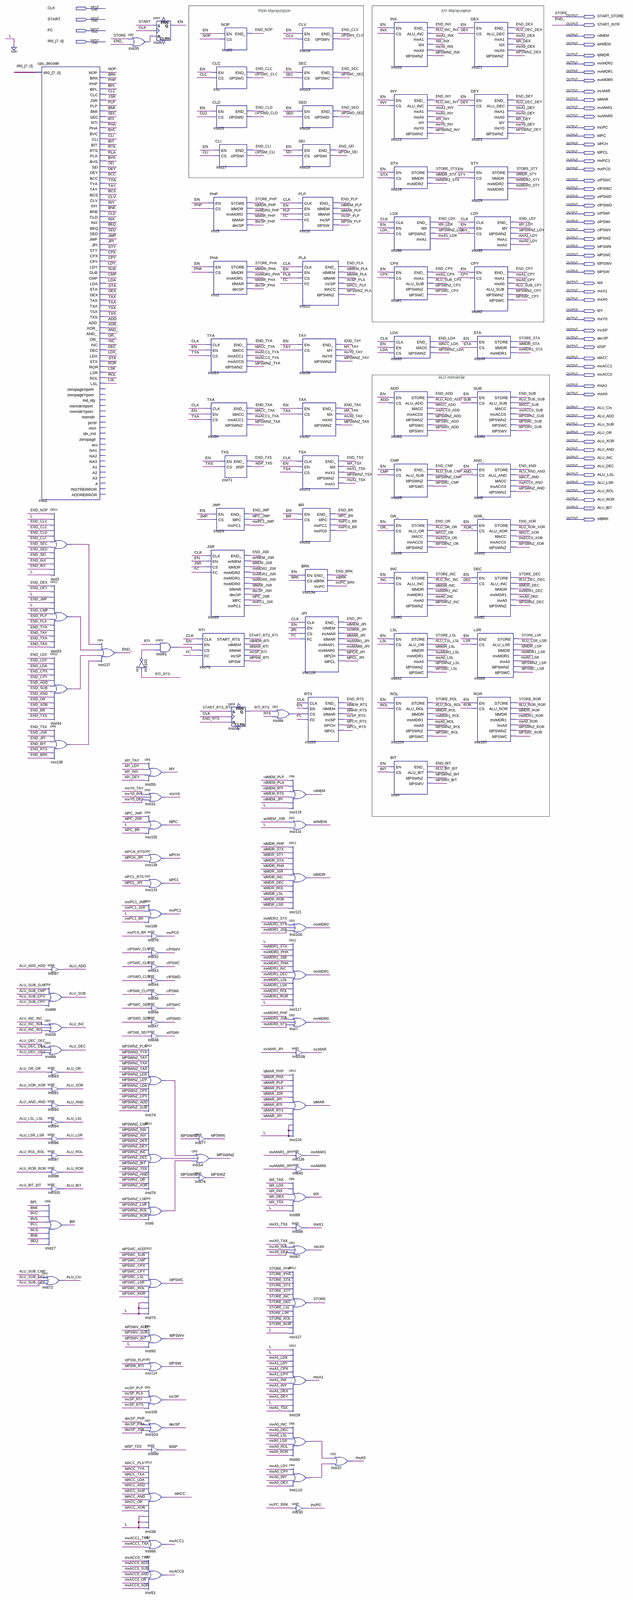
[diagram p0: schematic sheet, whole]
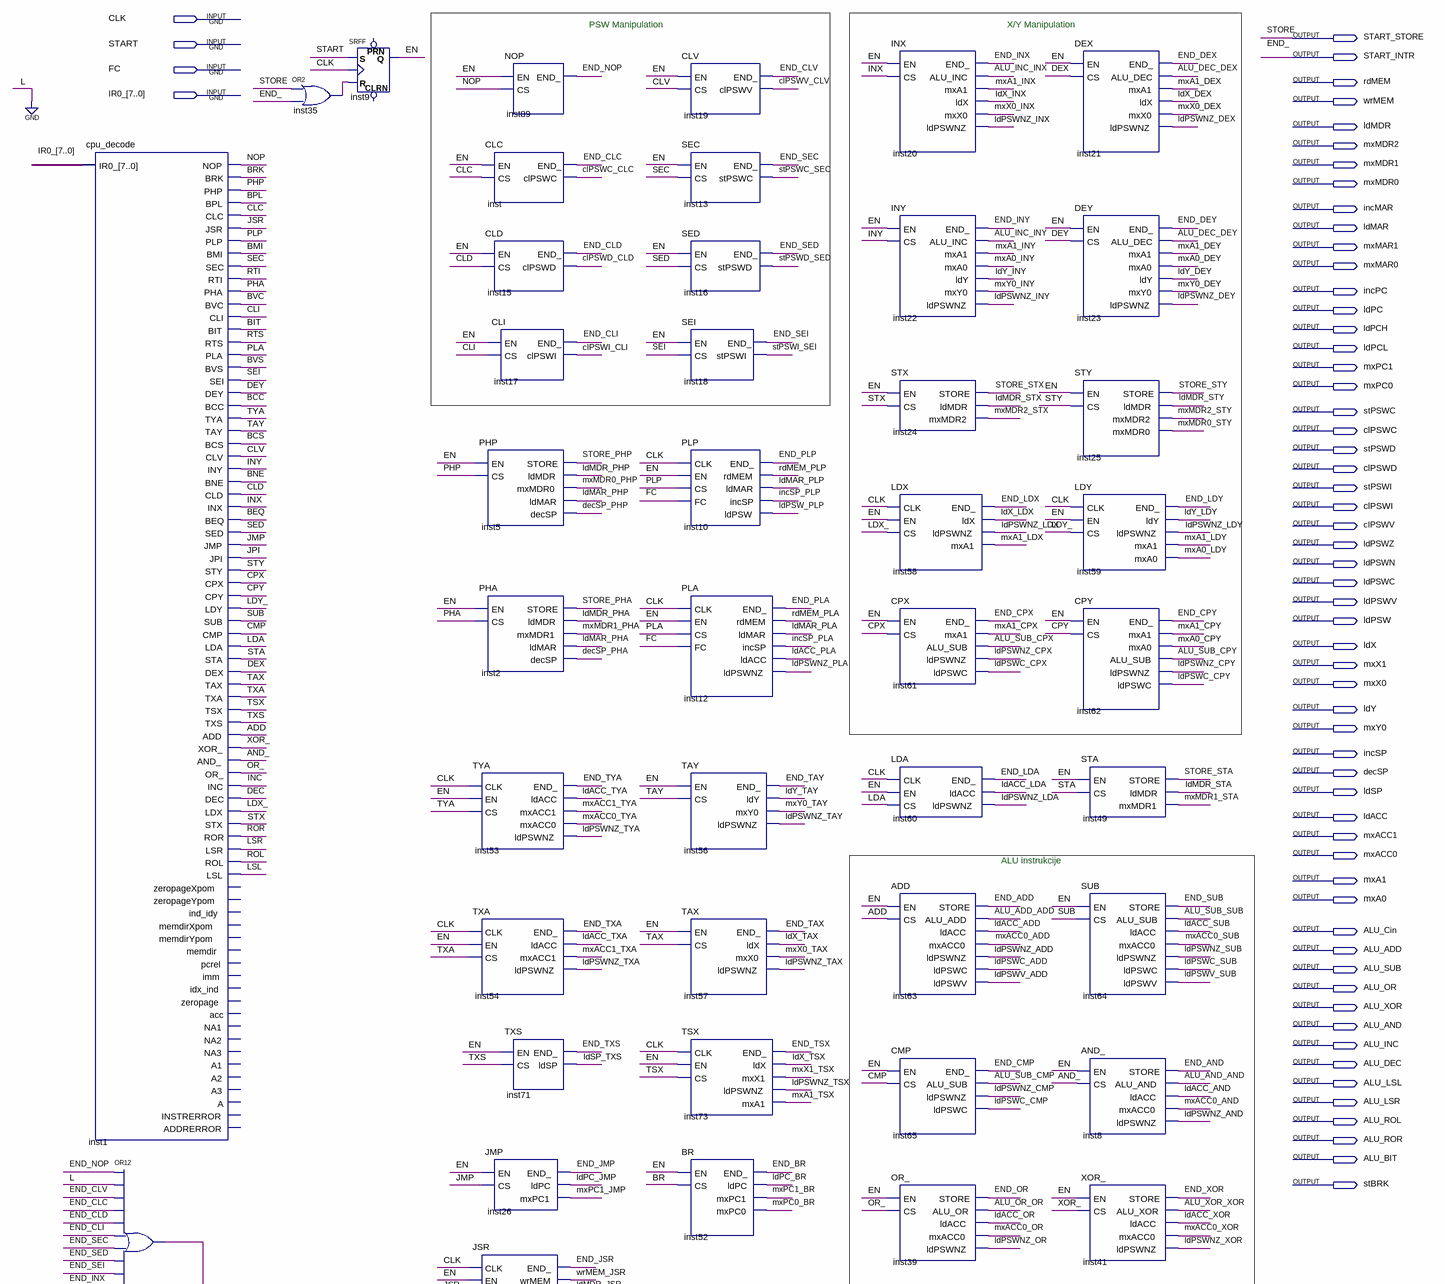
[diagram p1: schematic sheet, upper part]
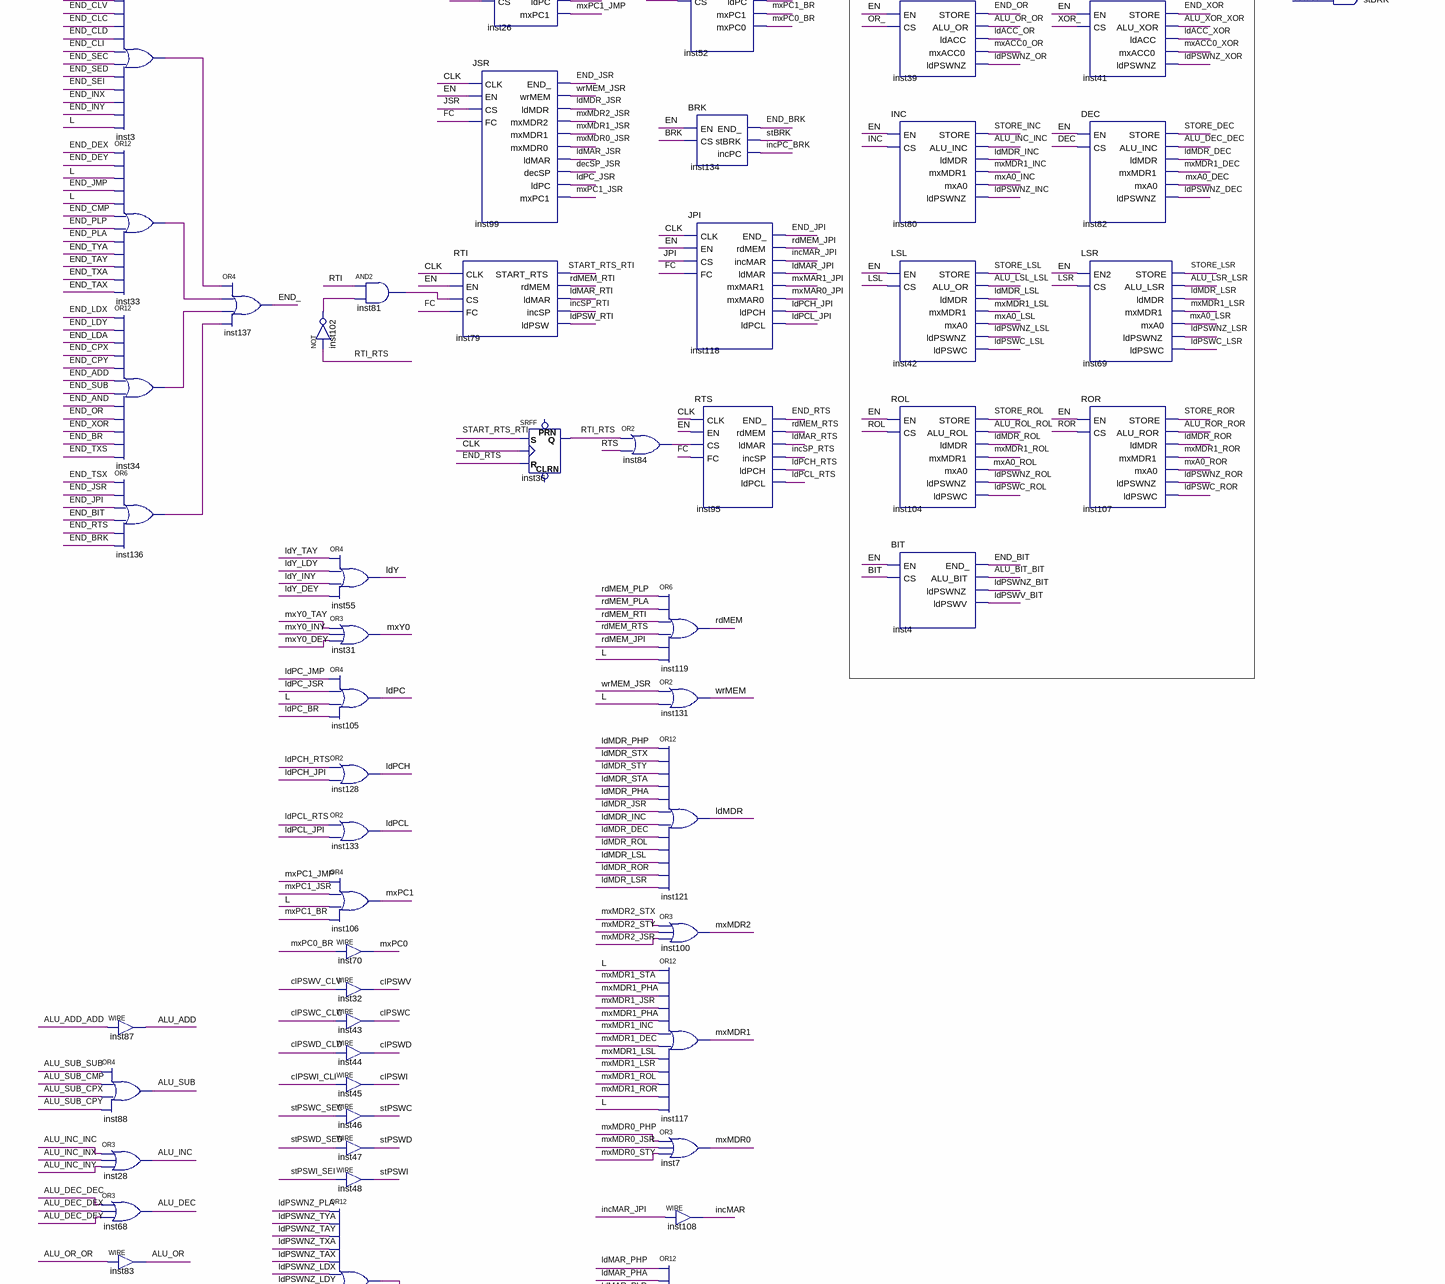
[diagram p2: schematic sheet, middle part]
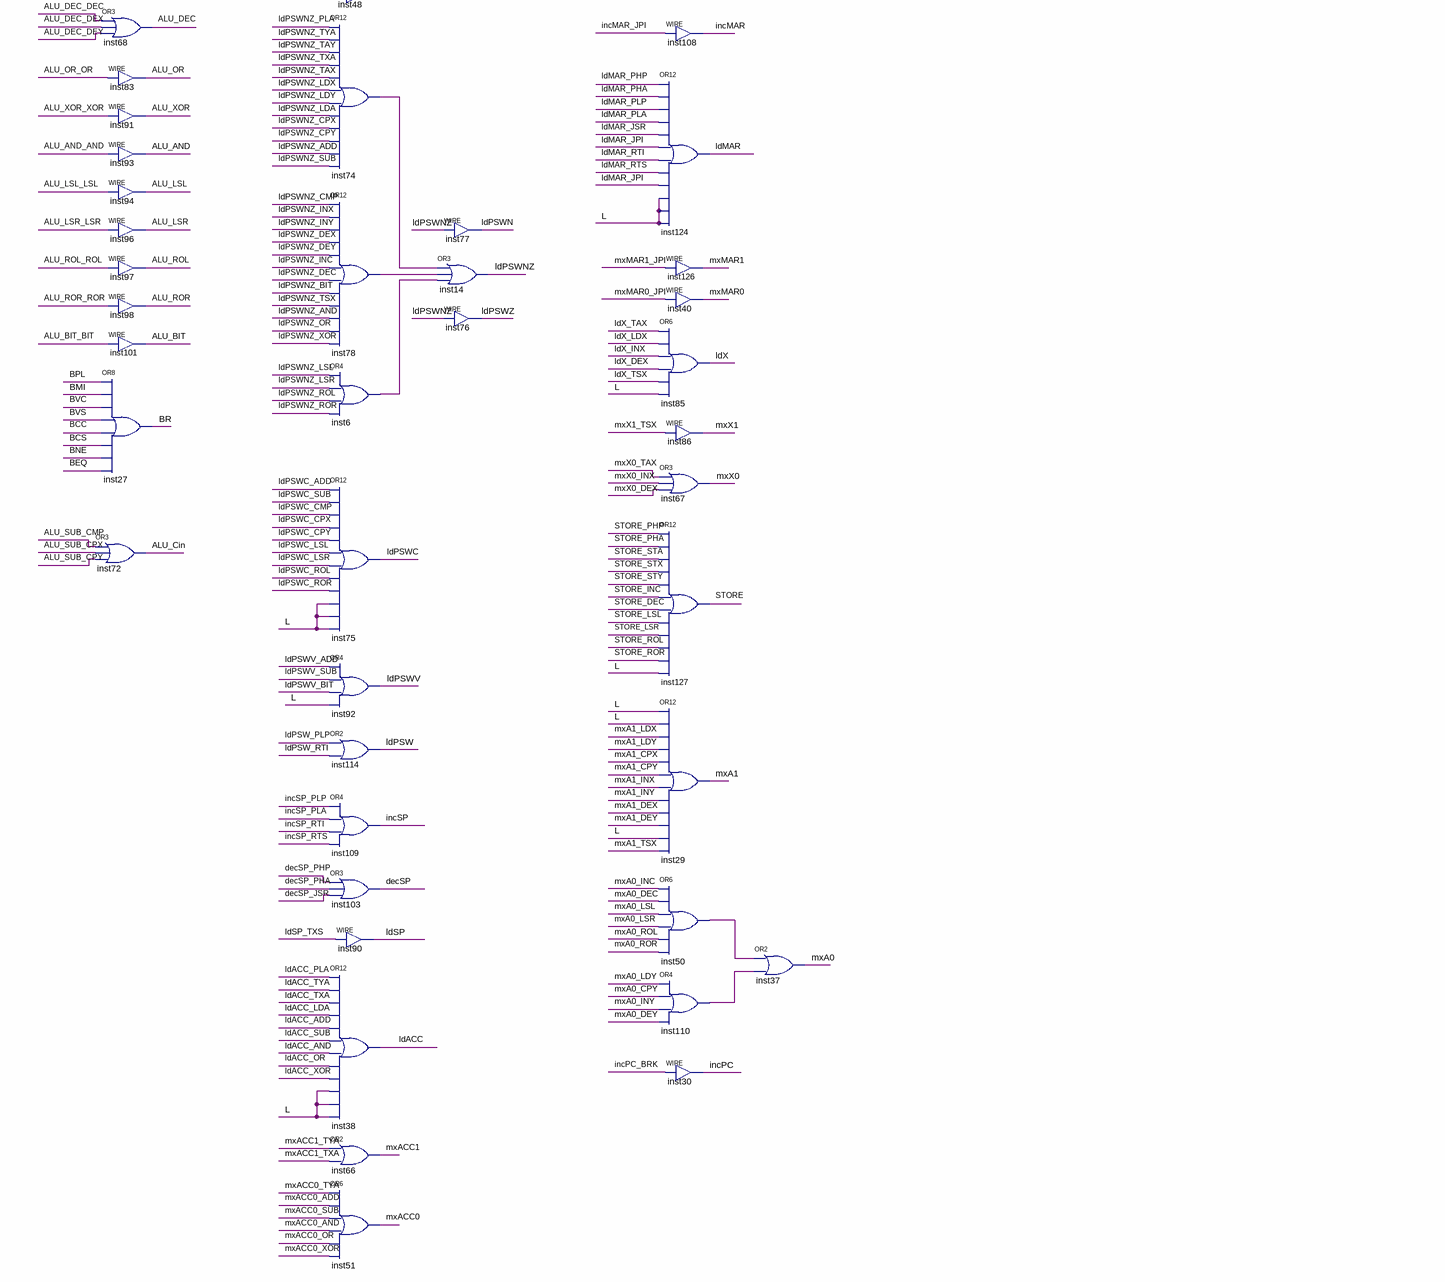
[diagram p3: schematic sheet, lower part]
// Quartus schematic cpu_exec.bdf as structural Verilog: 124 symbols, 61 pins
module cpu_exec (
  input  CLK,
  input  START,
  input  FC,
  input  [7:0] IR0_,
  output START_STORE,
  output START_INTR,
  output rdMEM,
  output wrMEM,
  output ldMDR,
  output mxMDR2,
  output mxMDR1,
  output mxMDR0,
  output incMAR,
  output ldMAR,
  output mxMAR1,
  output mxMAR0,
  output incPC,
  output ldPC,
  output ldPCH,
  output ldPCL,
  output mxPC1,
  output mxPC0,
  output stPSWC,
  output clPSWC,
  output stPSWD,
  output clPSWD,
  output stPSWI,
  output clPSWI,
  output clPSWV,
  output ldPSWZ,
  output ldPSWN,
  output ldPSWC,
  output ldPSWV,
  output ldPSW,
  output ldX,
  output mxX1,
  output mxX0,
  output ldY,
  output mxY0,
  output incSP,
  output decSP,
  output ldSP,
  output ldACC,
  output mxACC1,
  output mxACC0,
  output mxA1,
  output mxA0,
  output ALU_Cin,
  output ALU_ADD,
  output ALU_SUB,
  output ALU_OR,
  output ALU_XOR,
  output ALU_AND,
  output ALU_INC,
  output ALU_DEC,
  output ALU_LSL,
  output ALU_LSR,
  output ALU_ROL,
  output ALU_ROR,
  output ALU_BIT,
  output stBRK
);

  wire ADD, ALU_ADD_ADD, ALU_AND_AND, ALU_BIT_BIT, ALU_DEC_DEC, ALU_DEC_DEX, ALU_DEC_DEY, ALU_INC_INC,
       ALU_INC_INX, ALU_INC_INY, ALU_LSL_LSL, ALU_LSR_LSR, ALU_OR_OR, ALU_ROL_ROL, ALU_ROR_ROR, ALU_SUB_CMP,
       ALU_SUB_CPX, ALU_SUB_CPY, ALU_SUB_SUB, ALU_XOR_XOR, AND_, BCC, BCS, BEQ, BIT, BMI, BNE, BPL, BR, BRK,
       BVC, BVS, CLC, CLD, CLI, clPSWC_CLC, clPSWD_CLD, clPSWI_CLI, clPSWV_CLV, CLV, CMP, CPX, CPY, DEC,
       decSP_JSR, decSP_PHA, decSP_PHP, DEX, DEY, EN, END_ADD, END_AND, END_BIT, END_BR, END_BRK, END_CLC,
       END_CLD, END_CLI, END_CLV, END_CMP, END_CPX, END_CPY, END_DEX, END_DEY, END_INX, END_INY, END_JMP,
       END_JPI, END_JSR, END_LDA, END_LDX, END_LDY, END_NOP, END_OR, END_PLA, END_PLP, END_RTS, END_SEC,
       END_SED, END_SEI, END_SUB, END_TAX, END_TAY, END_TSX, END_TXA, END_TXS, END_TYA, END_XOR, INC,
       incMAR_JPI, incPC_BRK, incSP_PLA, incSP_PLP, incSP_RTI, incSP_RTS, inst3_out, inst6_out, inst33_out,
       inst34_out, inst35_out, inst50_out, inst74_out, inst78_out, inst81_out, inst84_out, inst102_out,
       inst110_out, inst136_out, INX, INY, JMP, JPI, JSR, LDA, ldACC_ADD, ldACC_AND, ldACC_LDA, ldACC_OR,
       ldACC_PLA, ldACC_SUB, ldACC_TXA, ldACC_TYA, ldACC_XOR, ldMAR_JPI, ldMAR_JSR, ldMAR_PHA, ldMAR_PHP,
       ldMAR_PLA, ldMAR_PLP, ldMAR_RTI, ldMAR_RTS, ldMDR_DEC, ldMDR_INC, ldMDR_JSR, ldMDR_LSL, ldMDR_LSR,
       ldMDR_PHA, ldMDR_PHP, ldMDR_ROL, ldMDR_ROR, ldMDR_STA, ldMDR_STX, ldMDR_STY, ldPC_BR, ldPC_JMP,
       ldPC_JSR, ldPCH_JPI, ldPCH_RTS, ldPCL_JPI, ldPCL_RTS, ldPSW_PLP, ldPSW_RTI, ldPSWC_ADD, ldPSWC_CMP,
       ldPSWC_CPX, ldPSWC_CPY, ldPSWC_LSL, ldPSWC_LSR, ldPSWC_ROL, ldPSWC_ROR, ldPSWC_SUB, ldPSWNZ,
       ldPSWNZ_ADD, ldPSWNZ_AND, ldPSWNZ_BIT, ldPSWNZ_CMP, ldPSWNZ_CPX, ldPSWNZ_CPY, ldPSWNZ_DEC,
       ldPSWNZ_DEX, ldPSWNZ_DEY, ldPSWNZ_INC, ldPSWNZ_INX, ldPSWNZ_INY, ldPSWNZ_LDA, ldPSWNZ_LDX,
       ldPSWNZ_LDY, ldPSWNZ_LSL, ldPSWNZ_LSR, ldPSWNZ_OR, ldPSWNZ_PLA, ldPSWNZ_ROL, ldPSWNZ_ROR, ldPSWNZ_SUB,
       ldPSWNZ_TAX, ldPSWNZ_TAY, ldPSWNZ_TSX, ldPSWNZ_TXA, ldPSWNZ_TYA, ldPSWNZ_XOR, ldPSWV_ADD, ldPSWV_BIT,
       ldPSWV_SUB, ldSP_TXS, LDX_, ldX_DEX, ldX_INX, ldX_LDX, ldX_TAX, ldX_TSX, LDY_, ldY_DEY, ldY_INY,
       ldY_LDY, ldY_TAY, LSL, LSR, mxA0_CPY, mxA0_DEC, mxA0_DEY, mxA0_INC, mxA0_INY, mxA0_LDY, mxA0_LSL,
       mxA0_LSR, mxA0_ROL, mxA0_ROR, mxA1_CPX, mxA1_CPY, mxA1_DEX, mxA1_DEY, mxA1_INX, mxA1_INY, mxA1_LDX,
       mxA1_LDY, mxA1_TSX, mxACC0_ADD, mxACC0_AND, mxACC0_OR, mxACC0_SUB, mxACC0_TYA, mxACC0_XOR, mxACC1_TXA,
       mxACC1_TYA, mxMAR0_JPI, mxMAR1_JPI, mxMDR0_JSR, mxMDR0_PHP, mxMDR0_STY, mxMDR1_DEC, mxMDR1_INC,
       mxMDR1_JSR, mxMDR1_LSL, mxMDR1_LSR, mxMDR1_PHA, mxMDR1_ROL, mxMDR1_ROR, mxMDR1_STA, mxMDR2_JSR,
       mxMDR2_STX, mxMDR2_STY, mxPC0_BR, mxPC1_BR, mxPC1_JMP, mxPC1_JSR, mxX0_DEX, mxX0_INX, mxX0_TAX,
       mxX1_TSX, mxY0_DEY, mxY0_INY, mxY0_TAY, NOP, OR_, PHA, PHP, PLA, PLP, rdMEM_JPI, rdMEM_PLA, rdMEM_PLP,
       rdMEM_RTI, rdMEM_RTS, ROL, ROR, RTI, RTI_RTS, RTS, SEC, SED, SEI, STA, START_RTS_RTI, STORE_DEC,
       STORE_INC, STORE_LSL, STORE_LSR, STORE_PHA, STORE_PHP, STORE_ROL, STORE_ROR, STORE_STA, STORE_STX,
       STORE_STY, stPSWC_SEC, stPSWD_SED, stPSWI_SEI, STX, STY, SUB, TAX, TAY, TSX, TXA, TXS, TYA, wrMEM_JSR,
       XOR_;

  cpu_decode inst1 (
    .IR0_(IR0_), .NOP(NOP), .BRK(BRK), .PHP(PHP), .BPL(BPL), .CLC(CLC), .JSR(JSR), .PLP(PLP), .BMI(BMI),
    .SEC(SEC), .RTI(RTI), .PHA(PHA), .BVC(BVC), .CLI(CLI), .BIT(BIT), .RTS(RTS), .PLA(PLA), .BVS(BVS),
    .SEI(SEI), .DEY(DEY), .BCC(BCC), .TYA(TYA), .TAY(TAY), .BCS(BCS), .CLV(CLV), .INY(INY), .BNE(BNE),
    .CLD(CLD), .INX(INX), .BEQ(BEQ), .SED(SED), .JMP(JMP), .JPI(JPI), .STY(STY), .CPX(CPX), .CPY(CPY),
    .LDY(LDY_), .SUB(SUB), .CMP(CMP), .LDA(LDA), .STA(STA), .DEX(DEX), .TAX(TAX), .TXA(TXA), .TSX(TSX),
    .TXS(TXS), .ADD(ADD), .XOR_(XOR_), .AND_(AND_), .OR_(OR_), .INC(INC), .DEC(DEC), .LDX(LDX_), .STX(STX),
    .ROR(ROR), .LSR(LSR), .ROL(ROL), .LSL(LSL));  // open: zeropageXpom, zeropageYpom, ind_idy, memdirXpom, memdirYpom, memdir, pcrel, imm, idx_ind, zeropage, acc, NA1, NA2, NA3, A1, A2, A3, A, INSTRERROR, ADDRERROR
  or inst72 (ALU_Cin, ALU_SUB_CMP, ALU_SUB_CPX, ALU_SUB_CPY);
  or inst3 (inst3_out, END_NOP, 1'b0, END_CLV, END_CLC, END_CLD, END_CLI, END_SEC, END_SED, END_SEI, END_INX, END_INY, 1'b0);
  or inst33 (inst33_out, END_DEX, END_DEY, 1'b0, END_JMP, 1'b0, END_CMP, END_PLP, END_PLA, END_TYA, END_TAY, END_TXA, END_TAX);
  or inst34 (inst34_out, END_LDX, END_LDY, END_LDA, END_CPX, END_CPY, END_ADD, END_SUB, END_AND, END_OR, END_XOR, END_BR, END_TXS);
  or inst136 (inst136_out, END_TSX, END_JSR, END_JPI, END_BIT, END_RTS, END_BRK);
  assign ALU_ADD = ALU_ADD_ADD;  // WIRE inst87
  or inst88 (ALU_SUB, ALU_SUB_SUB, ALU_SUB_CMP, ALU_SUB_CPX, ALU_SUB_CPY);
  or inst28 (ALU_INC, ALU_INC_INC, ALU_INC_INX, ALU_INC_INY);
  or inst68 (ALU_DEC, ALU_DEC_DEC, ALU_DEC_DEX, ALU_DEC_DEY);
  assign ALU_OR = ALU_OR_OR;  // WIRE inst83
  assign ALU_XOR = ALU_XOR_XOR;  // WIRE inst91
  assign ALU_AND = ALU_AND_AND;  // WIRE inst93
  assign ALU_LSL = ALU_LSL_LSL;  // WIRE inst94
  assign ALU_LSR = ALU_LSR_LSR;  // WIRE inst96
  assign ALU_ROL = ALU_ROL_ROL;  // WIRE inst97
  assign ALU_ROR = ALU_ROR_ROR;  // WIRE inst98
  assign ALU_BIT = ALU_BIT_BIT;  // WIRE inst101
  or inst27 (BR, BPL, BMI, BVC, BVS, BCC, BCS, BNE, BEQ);
  or inst137 (START_INTR, inst3_out, inst33_out, inst34_out, inst136_out);
  or inst35 (inst35_out, START_STORE, START_INTR);
  SRFF inst9 (.S(START), .R(inst35_out), .CLK(CLK), .Q(EN));  // open: PRN, CLRN
  not inst102 (inst102_out, RTI_RTS);
  or inst55 (ldY, ldY_TAY, ldY_LDY, ldY_INY, ldY_DEY);
  or inst31 (mxY0, mxY0_TAY, mxY0_INY, mxY0_DEY);
  or inst105 (ldPC, ldPC_JMP, ldPC_JSR, 1'b0, ldPC_BR);
  or inst128 (ldPCH, ldPCH_RTS, ldPCH_JPI);
  or inst133 (ldPCL, ldPCL_RTS, ldPCL_JPI);
  or inst106 (mxPC1, mxPC1_JMP, mxPC1_JSR, 1'b0, mxPC1_BR);
  assign mxPC0 = mxPC0_BR;  // WIRE inst70
  assign clPSWV = clPSWV_CLV;  // WIRE inst32
  assign clPSWC = clPSWC_CLC;  // WIRE inst43
  assign clPSWD = clPSWD_CLD;  // WIRE inst44
  assign clPSWI = clPSWI_CLI;  // WIRE inst45
  assign stPSWC = stPSWC_SEC;  // WIRE inst46
  assign stPSWD = stPSWD_SED;  // WIRE inst47
  assign stPSWI = stPSWI_SEI;  // WIRE inst48
  or inst74 (inst74_out, ldPSWNZ_PLA, ldPSWNZ_TYA, ldPSWNZ_TAY, ldPSWNZ_TXA, ldPSWNZ_TAX, ldPSWNZ_LDX, ldPSWNZ_LDY, ldPSWNZ_LDA, ldPSWNZ_CPX, ldPSWNZ_CPY, ldPSWNZ_ADD, ldPSWNZ_SUB);
  or inst78 (inst78_out, ldPSWNZ_CMP, ldPSWNZ_INX, ldPSWNZ_INY, ldPSWNZ_DEX, ldPSWNZ_DEY, ldPSWNZ_INC, ldPSWNZ_DEC, ldPSWNZ_BIT, ldPSWNZ_TSX, ldPSWNZ_AND, ldPSWNZ_OR, ldPSWNZ_XOR);
  or inst6 (inst6_out, ldPSWNZ_LSL, ldPSWNZ_LSR, ldPSWNZ_ROL, ldPSWNZ_ROR);
  or inst75 (ldPSWC, ldPSWC_ADD, ldPSWC_SUB, ldPSWC_CMP, ldPSWC_CPX, ldPSWC_CPY, ldPSWC_LSL, ldPSWC_LSR, ldPSWC_ROL, ldPSWC_ROR, 1'b0, 1'b0, 1'b0);
  or inst92 (ldPSWV, ldPSWV_ADD, ldPSWV_SUB, ldPSWV_BIT, 1'b0);
  or inst114 (ldPSW, ldPSW_PLP, ldPSW_RTI);
  or inst109 (incSP, incSP_PLP, incSP_PLA, incSP_RTI, incSP_RTS);
  or inst103 (decSP, decSP_PHP, decSP_PHA, decSP_JSR);
  assign ldSP = ldSP_TXS;  // WIRE inst90
  or inst38 (ldACC, ldACC_PLA, ldACC_TYA, ldACC_TXA, ldACC_LDA, ldACC_ADD, ldACC_SUB, ldACC_AND, ldACC_OR, ldACC_XOR, 1'b0, 1'b0, 1'b0);
  or inst66 (mxACC1, mxACC1_TYA, mxACC1_TXA);
  or inst51 (mxACC0, mxACC0_TYA, mxACC0_ADD, mxACC0_SUB, mxACC0_AND, mxACC0_OR, mxACC0_XOR);
  and inst81 (inst81_out, RTI, inst102_out);
  RTI inst79 (
    .CLK(CLK), .EN(EN), .CS(inst81_out), .FC(FC), .START_RTS(START_RTS_RTI), .rdMEM(rdMEM_RTI),
    .ldMAR(ldMAR_RTI), .incSP(incSP_RTI), .ldPSW(ldPSW_RTI));
  assign ldPSWN = ldPSWNZ;  // WIRE inst77
  or inst14 (ldPSWNZ, inst74_out, inst78_out, inst6_out);
  assign ldPSWZ = ldPSWNZ;  // WIRE inst76
  NOP inst89 (.EN(EN), .CS(NOP), .END_(END_NOP));
  CLC inst (.EN(EN), .CS(CLC), .END_(END_CLC), .clPSWC(clPSWC_CLC));
  CLD inst15 (.EN(EN), .CS(CLD), .END_(END_CLD), .clPSWD(clPSWD_CLD));
  CLI inst17 (.EN(EN), .CS(CLI), .END_(END_CLI), .clPSWI(clPSWI_CLI));
  PHP inst5 (
    .EN(EN), .CS(PHP), .STORE(STORE_PHP), .ldMDR(ldMDR_PHP), .mxMDR0(mxMDR0_PHP), .ldMAR(ldMAR_PHP),
    .decSP(decSP_PHP));
  PHA inst2 (
    .EN(EN), .CS(PHA), .STORE(STORE_PHA), .ldMDR(ldMDR_PHA), .mxMDR1(mxMDR1_PHA), .ldMAR(ldMAR_PHA),
    .decSP(decSP_PHA));
  TYA inst53 (
    .CLK(CLK), .EN(EN), .CS(TYA), .END_(END_TYA), .ldACC(ldACC_TYA), .mxACC1(mxACC1_TYA),
    .mxACC0(mxACC0_TYA), .ldPSWNZ(ldPSWNZ_TYA));
  TXA inst54 (
    .CLK(CLK), .EN(EN), .CS(TXA), .END_(END_TXA), .ldACC(ldACC_TXA), .mxACC1(mxACC1_TXA),
    .ldPSWNZ(ldPSWNZ_TXA));
  TXS inst71 (.EN(EN), .CS(TXS), .END_(END_TXS), .ldSP(ldSP_TXS));
  JMP inst26 (.EN(EN), .CS(JMP), .END_(END_JMP), .ldPC(ldPC_JMP), .mxPC1(mxPC1_JMP));
  JSR inst99 (
    .CLK(CLK), .EN(EN), .CS(JSR), .FC(FC), .END_(END_JSR), .wrMEM(wrMEM_JSR), .ldMDR(ldMDR_JSR),
    .mxMDR2(mxMDR2_JSR), .mxMDR1(mxMDR1_JSR), .mxMDR0(mxMDR0_JSR), .ldMAR(ldMAR_JSR), .decSP(decSP_JSR),
    .ldPC(ldPC_JSR), .mxPC1(mxPC1_JSR));
  SRFF inst36 (.S(START_RTS_RTI), .R(END_RTS), .CLK(CLK), .Q(RTI_RTS));  // open: PRN, CLRN
  or inst84 (inst84_out, RTI_RTS, RTS);
  CLV inst19 (.EN(EN), .CS(CLV), .END_(END_CLV), .clPSWV(clPSWV_CLV));
  SEC inst13 (.EN(EN), .CS(SEC), .END_(END_SEC), .stPSWC(stPSWC_SEC));
  SED inst16 (.EN(EN), .CS(SED), .END_(END_SED), .stPSWD(stPSWD_SED));
  SEI inst18 (.EN(EN), .CS(SEI), .END_(END_SEI), .stPSWI(stPSWI_SEI));
  PLP inst10 (
    .CLK(CLK), .EN(EN), .CS(PLP), .FC(FC), .END_(END_PLP), .rdMEM(rdMEM_PLP), .ldMAR(ldMAR_PLP),
    .incSP(incSP_PLP), .ldPSW(ldPSW_PLP));
  PLA inst12 (
    .CLK(CLK), .EN(EN), .CS(PLA), .FC(FC), .END_(END_PLA), .rdMEM(rdMEM_PLA), .ldMAR(ldMAR_PLA),
    .incSP(incSP_PLA), .ldACC(ldACC_PLA), .ldPSWNZ(ldPSWNZ_PLA));
  TAY inst56 (.EN(EN), .CS(TAY), .END_(END_TAY), .ldY(ldY_TAY), .mxY0(mxY0_TAY), .ldPSWNZ(ldPSWNZ_TAY));
  TAX inst57 (.EN(EN), .CS(TAX), .END_(END_TAX), .ldX(ldX_TAX), .mxX0(mxX0_TAX), .ldPSWNZ(ldPSWNZ_TAX));
  TSX inst73 (
    .CLK(CLK), .EN(EN), .CS(TSX), .END_(END_TSX), .ldX(ldX_TSX), .mxX1(mxX1_TSX), .ldPSWNZ(ldPSWNZ_TSX),
    .mxA1(mxA1_TSX));
  BR inst52 (.EN(EN), .CS(BR), .END_(END_BR), .ldPC(ldPC_BR), .mxPC1(mxPC1_BR), .mxPC0(mxPC0_BR));
  BRK inst134 (.EN(EN), .CS(BRK), .END_(END_BRK), .stBRK(stBRK), .incPC(incPC_BRK));
  JPI inst118 (
    .CLK(CLK), .EN(EN), .CS(JPI), .FC(FC), .END_(END_JPI), .rdMEM(rdMEM_JPI), .incMAR(incMAR_JPI),
    .ldMAR(ldMAR_JPI), .mxMAR1(mxMAR1_JPI), .mxMAR0(mxMAR0_JPI), .ldPCH(ldPCH_JPI), .ldPCL(ldPCL_JPI));
  RTS inst95 (
    .CLK(CLK), .EN(EN), .CS(inst84_out), .FC(FC), .END_(END_RTS), .rdMEM(rdMEM_RTS), .ldMAR(ldMAR_RTS),
    .incSP(incSP_RTS), .ldPCH(ldPCH_RTS), .ldPCL(ldPCL_RTS));
  or inst119 (rdMEM, rdMEM_PLP, rdMEM_PLA, rdMEM_RTI, rdMEM_RTS, rdMEM_JPI, 1'b0);
  or inst131 (wrMEM, wrMEM_JSR, 1'b0);
  or inst121 (ldMDR, ldMDR_PHP, ldMDR_STX, ldMDR_STY, ldMDR_STA, ldMDR_PHA, ldMDR_JSR, ldMDR_INC, ldMDR_DEC, ldMDR_ROL, ldMDR_LSL, ldMDR_ROR, ldMDR_LSR);
  or inst100 (mxMDR2, mxMDR2_STX, mxMDR2_STY, mxMDR2_JSR);
  or inst117 (mxMDR1, 1'b0, mxMDR1_STA, mxMDR1_PHA, mxMDR1_JSR, mxMDR1_PHA, mxMDR1_INC, mxMDR1_DEC, mxMDR1_LSL, mxMDR1_LSR, mxMDR1_ROL, mxMDR1_ROR, 1'b0);
  or inst7 (mxMDR0, mxMDR0_PHP, mxMDR0_JSR, mxMDR0_STY);
  assign incMAR = incMAR_JPI;  // WIRE inst108
  or inst124 (ldMAR, ldMAR_PHP, ldMAR_PHA, ldMAR_PLP, ldMAR_PLA, ldMAR_JSR, ldMAR_JPI, ldMAR_RTI, ldMAR_RTS, ldMAR_JPI, 1'b0, 1'b0, 1'b0);
  assign mxMAR1 = mxMAR1_JPI;  // WIRE inst126
  assign mxMAR0 = mxMAR0_JPI;  // WIRE inst40
  or inst85 (ldX, ldX_TAX, ldX_LDX, ldX_INX, ldX_DEX, ldX_TSX, 1'b0);
  assign mxX1 = mxX1_TSX;  // WIRE inst86
  or inst67 (mxX0, mxX0_TAX, mxX0_INX, mxX0_DEX);
  or inst127 (START_STORE, STORE_PHP, STORE_PHA, STORE_STA, STORE_STX, STORE_STY, STORE_INC, STORE_DEC, STORE_LSL, STORE_LSR, STORE_ROL, STORE_ROR, 1'b0);
  or inst29 (mxA1, 1'b0, 1'b0, mxA1_LDX, mxA1_LDY, mxA1_CPX, mxA1_CPY, mxA1_INX, mxA1_INY, mxA1_DEX, mxA1_DEY, 1'b0, mxA1_TSX);
  or inst50 (inst50_out, mxA0_INC, mxA0_DEC, mxA0_LSL, mxA0_LSR, mxA0_ROL, mxA0_ROR);
  or inst110 (inst110_out, mxA0_LDY, mxA0_CPY, mxA0_INY, mxA0_DEY);
  assign incPC = incPC_BRK;  // WIRE inst30
  or inst37 (mxA0, inst50_out, inst110_out);
  INX inst20 (
    .EN(EN), .CS(INX), .END_(END_INX), .ALU_INC(ALU_INC_INX), .mxA1(mxA1_INX), .ldX(ldX_INX),
    .mxX0(mxX0_INX), .ldPSWNZ(ldPSWNZ_INX));
  INY inst22 (
    .EN(EN), .CS(INY), .END_(END_INY), .ALU_INC(ALU_INC_INY), .mxA1(mxA1_INY), .mxA0(mxA0_INY),
    .ldY(ldY_INY), .mxY0(mxY0_INY), .ldPSWNZ(ldPSWNZ_INY));
  STX inst24 (.EN(EN), .CS(STX), .STORE(STORE_STX), .ldMDR(ldMDR_STX), .mxMDR2(mxMDR2_STX));
  LDX inst58 (.CLK(CLK), .EN(EN), .CS(LDX_), .END_(END_LDX), .ldX(ldX_LDX), .ldPSWNZ(ldPSWNZ_LDX), .mxA1(mxA1_LDX));
  CPX inst61 (
    .EN(EN), .CS(CPX), .END_(END_CPX), .mxA1(mxA1_CPX), .ALU_SUB(ALU_SUB_CPX), .ldPSWNZ(ldPSWNZ_CPX),
    .ldPSWC(ldPSWC_CPX));
  LDA inst60 (.CLK(CLK), .EN(EN), .CS(LDA), .END_(END_LDA), .ldACC(ldACC_LDA), .ldPSWNZ(ldPSWNZ_LDA));
  ADD inst63 (
    .EN(EN), .CS(ADD), .STORE(END_ADD), .ALU_ADD(ALU_ADD_ADD), .ldACC(ldACC_ADD), .mxACC0(mxACC0_ADD),
    .ldPSWNZ(ldPSWNZ_ADD), .ldPSWC(ldPSWC_ADD), .ldPSWV(ldPSWV_ADD));
  CMP inst65 (.EN(EN), .CS(CMP), .END_(END_CMP), .ALU_SUB(ALU_SUB_CMP), .ldPSWNZ(ldPSWNZ_CMP), .ldPSWC(ldPSWC_CMP));
  OR_ inst39 (
    .EN(EN), .CS(OR_), .STORE(END_OR), .ALU_OR(ALU_OR_OR), .ldACC(ldACC_OR), .mxACC0(mxACC0_OR),
    .ldPSWNZ(ldPSWNZ_OR));
  INC inst80 (
    .EN(EN), .CS(INC), .STORE(STORE_INC), .ALU_INC(ALU_INC_INC), .ldMDR(ldMDR_INC), .mxMDR1(mxMDR1_INC),
    .mxA0(mxA0_INC), .ldPSWNZ(ldPSWNZ_INC));
  LSL inst42 (
    .EN(EN), .CS(LSL), .STORE(STORE_LSL), .ALU_OR(ALU_LSL_LSL), .ldMDR(ldMDR_LSL), .mxMDR1(mxMDR1_LSL),
    .mxA0(mxA0_LSL), .ldPSWNZ(ldPSWNZ_LSL), .ldPSWC(ldPSWC_LSL));
  ROL inst104 (
    .EN(EN), .CS(ROL), .STORE(STORE_ROL), .ALU_ROL(ALU_ROL_ROL), .ldMDR(ldMDR_ROL), .mxMDR1(mxMDR1_ROL),
    .mxA0(mxA0_ROL), .ldPSWNZ(ldPSWNZ_ROL), .ldPSWC(ldPSWC_ROL));
  BIT inst4 (.EN(EN), .CS(BIT), .END_(END_BIT), .ALU_BIT(ALU_BIT_BIT), .ldPSWNZ(ldPSWNZ_BIT), .ldPSWV(ldPSWV_BIT));
  DEX inst21 (
    .EN(EN), .CS(DEX), .END_(END_DEX), .ALU_DEC(ALU_DEC_DEX), .mxA1(mxA1_DEX), .ldX(ldX_DEX),
    .mxX0(mxX0_DEX), .ldPSWNZ(ldPSWNZ_DEX));
  DEY inst23 (
    .EN(EN), .CS(DEY), .END_(END_DEY), .ALU_DEC(ALU_DEC_DEY), .mxA1(mxA1_DEY), .mxA0(mxA0_DEY),
    .ldY(ldY_DEY), .mxY0(mxY0_DEY), .ldPSWNZ(ldPSWNZ_DEY));
  STY inst25 (.EN(EN), .CS(STY), .STORE(STORE_STY), .ldMDR(ldMDR_STY), .mxMDR2(mxMDR2_STY), .mxMDR0(mxMDR0_STY));
  LDY inst59 (
    .CLK(CLK), .EN(EN), .CS(LDY_), .END_(END_LDY), .ldY(ldY_LDY), .ldPSWNZ(ldPSWNZ_LDY), .mxA1(mxA1_LDY),
    .mxA0(mxA0_LDY));
  CPY inst62 (
    .EN(EN), .CS(CPY), .END_(END_CPY), .mxA1(mxA1_CPY), .mxA0(mxA0_CPY), .ALU_SUB(ALU_SUB_CPY),
    .ldPSWNZ(ldPSWNZ_CPY), .ldPSWC(ldPSWC_CPY));
  STA inst49 (.EN(EN), .CS(STA), .STORE(STORE_STA), .ldMDR(ldMDR_STA), .mxMDR1(mxMDR1_STA));
  SUB inst64 (
    .EN(EN), .CS(SUB), .STORE(END_SUB), .ALU_SUB(ALU_SUB_SUB), .ldACC(ldACC_SUB), .mxACC0(mxACC0_SUB),
    .ldPSWNZ(ldPSWNZ_SUB), .ldPSWC(ldPSWC_SUB), .ldPSWV(ldPSWV_SUB));
  AND_ inst8 (
    .EN(EN), .CS(AND_), .STORE(END_AND), .ALU_AND(ALU_AND_AND), .ldACC(ldACC_AND), .mxACC0(mxACC0_AND),
    .ldPSWNZ(ldPSWNZ_AND));
  XOR_ inst41 (
    .EN(EN), .CS(XOR_), .STORE(END_XOR), .ALU_XOR(ALU_XOR_XOR), .ldACC(ldACC_XOR), .mxACC0(mxACC0_XOR),
    .ldPSWNZ(ldPSWNZ_XOR));
  DEC inst82 (
    .EN(EN), .CS(DEC), .STORE(STORE_DEC), .ALU_INC(ALU_DEC_DEC), .ldMDR(ldMDR_DEC), .mxMDR1(mxMDR1_DEC),
    .mxA0(mxA0_DEC), .ldPSWNZ(ldPSWNZ_DEC));
  LSR inst69 (
    .EN2(EN), .CS(LSR), .STORE(STORE_LSR), .ALU_LSR(ALU_LSR_LSR), .ldMDR(ldMDR_LSR), .mxMDR1(mxMDR1_LSR),
    .mxA0(mxA0_LSR), .ldPSWNZ(ldPSWNZ_LSR), .ldPSWC(ldPSWC_LSR));
  ROR inst107 (
    .EN(EN), .CS(ROR), .STORE(STORE_ROR), .ALU_ROR(ALU_ROR_ROR), .ldMDR(ldMDR_ROR), .mxMDR1(mxMDR1_ROR),
    .mxA0(mxA0_ROR), .ldPSWNZ(ldPSWNZ_ROR), .ldPSWC(ldPSWC_ROR));

  // Other names for the same wires on the sheet: END_ = START_INTR; STORE = START_STORE

  // Notes on the sheet:
  //   PSW Manipulation
  //   X/Y Manipulation
  //   ALU instrukcije
endmodule
